# EAGLE design Air Quality Sensor V1.0 (EAGLE 7.7.0)
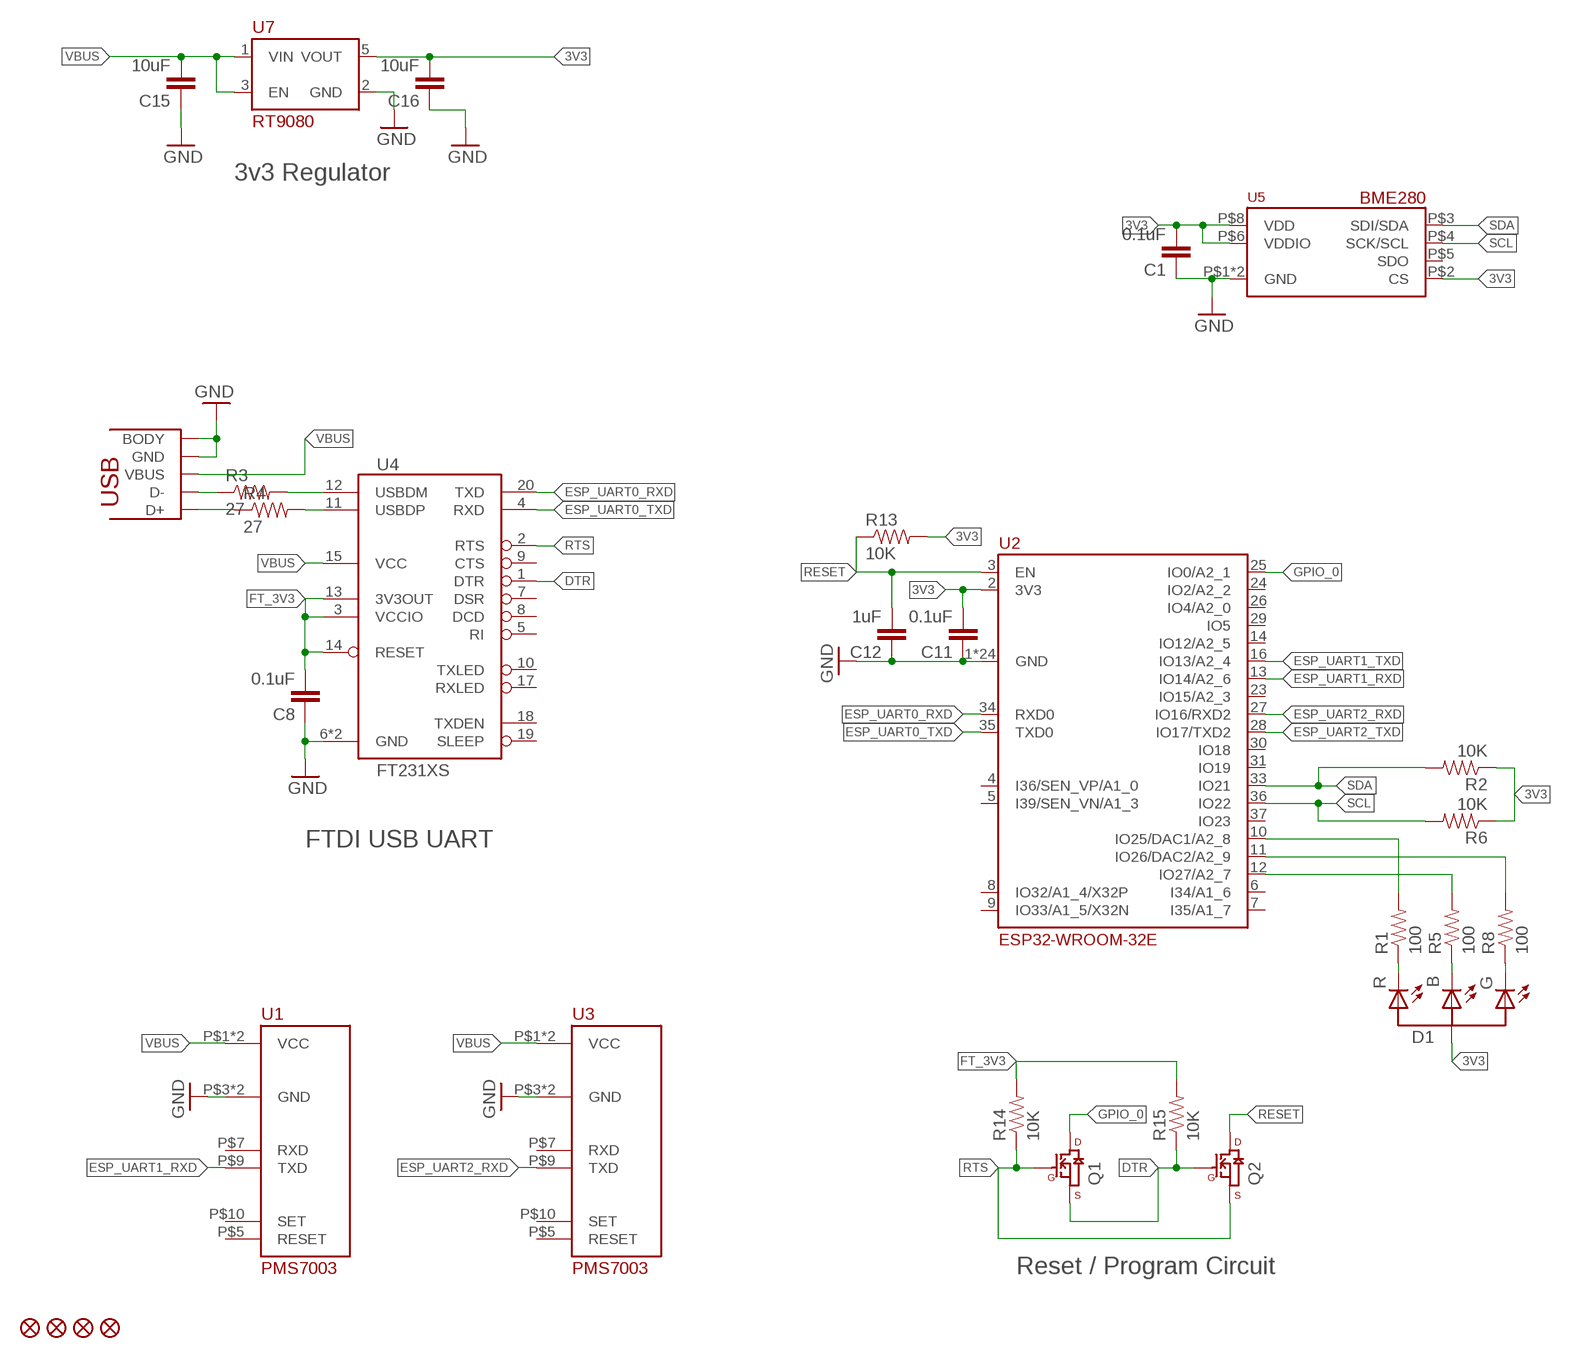
[diagram p0: schematic, sheet 1]

## Parts
C1  0.1uF  CAP0603-CAP  [0603-CAP]
C8  0.1uF  CAP0603-CAP  [0603-CAP]
C11  0.1uF  CAP0603-CAP  [0603-CAP]
C12  1uF  CAP0603-CAP  [0603-CAP]
C15  10uF  CAP1206  [1206]
C16  10uF  CAP1206  [1206]
D1  LED_TRICOLOR_COM-ANODE  [LED_1206_SIDE_TRICOLOR]
FID1  FIDUCIAL  [FIDUCIAL]
FID2  FIDUCIAL  [FIDUCIAL]
FID3  FIDUCIAL  [FIDUCIAL]
FID4  FIDUCIAL  [FIDUCIAL]
Q1  MOSFET_N_CHANNELSI1308  [SC-70-3]
Q2  MOSFET_N_CHANNELSI1308  [SC-70-3]
R1  100  RESISTOR0603-RES  [0603-RES]
R2  10K  RESISTOR0603-RES  [0603-RES]
R3  27  RESISTOR0603-RES  [0603-RES]
R4  27  RESISTOR0603-RES  [0603-RES]
R5  100  RESISTOR0603-RES  [0603-RES]
R6  10K  RESISTOR0603-RES  [0603-RES]
R8  100  RESISTOR0603-RES  [0603-RES]
R13  10K  RESISTOR0603-RES  [0603-RES]
R14  10K  RESISTOR0603-RES  [0603-RES]
R15  10K  RESISTOR0603-RES  [0603-RES]
U1  PMS7003_SMD  [PMS7003_SMD]
U2  ESP32-WROOM-32E  [ESP32-WROOM-32E]
U3  PMS7003_SMD  [PMS7003_SMD]
U4  FT231XS  [SSOP-20]
U5  BME280  [8-VFLGA]
U7  RT9080  [SOT-23-5]
U$1  USB-MICROB  [USB-MICROB-10118192]

## Nets
3V3: C1.2 C11.2 C16.2 D1.P$3(A) R2.1 R6.1 R13.2 U2.2(3V3) U5.P$2(CS) U5.P$6(VDDIO) U5.P$8(VDD) U7.5(VOUT)
DTR: Q1.P$2(S) Q2.P$1(G) R15.1 U4.1(DTR)
ESP_UART0_RXD: U2.34(RXD0) U4.20(TXD)
ESP_UART0_TXD: U2.35(TXD0) U4.4(RXD)
ESP_UART1_RXD: U1.P$9(TXD) U2.13(IO14/A2_6)
ESP_UART1_TXD: U2.16(IO13/A2_4)
ESP_UART2_RXD: U2.27(IO16/RXD2) U3.P$9(TXD)
ESP_UART2_TXD: U2.28(IO17/TXD2)
FT_3V3: C8.2 R14.2 R15.2 U4.3(VCCIO) U4.13(3V3OUT) U4.14(RESET)
GND: C1.1 C8.1 C11.1 C12.1 C15.1 C16.1 U1.P$3(GND) U1.P$4(GND) U2.1(GND) U2.15(GND) U2.38(GND) U2.P$1(GND) U2.P$2(GND) U2.P$3(GND) U2.P$4(GND) U2.P$5(GND) U2.P$6(GND) U2.P$7(GND) U2.P$8(GND) U2.P$9(GND) U2.P$10(GND) U2.P$11(GND) U2.P$12(GND) U2.PAD@1(GND) U2.PAD@2(GND) U2.PAD@3(GND) U2.PAD@4(GND) U2.PAD@5(GND) U2.PAD@6(GND) U2.PAD@7(GND) U2.PAD@8(GND) U2.PAD@9(GND) U3.P$3(GND) U3.P$4(GND) U4.6(GND) U4.16(GND) U5.P$1(GND) U5.P$7(GND) U7.2(GND) U$1.5(GND) U$1.BODY@1(BODY) U$1.BODY@2(BODY) U$1.BODY@3(BODY) U$1.BODY@4(BODY) U$1.BODY@5(BODY) U$1.BODY@6(BODY)
GPIO_0: Q1.P$3(D) U2.25(IO0/A2_1)
N$1: R1.2 U2.10(IO25/DAC1/A2_8)
N$2: R8.2 U2.11(IO26/DAC2/A2_9)
N$3: R5.2 U2.12(IO27/A2_7)
N$4: D1.P$4(C_RED) R1.1
N$5: D1.P$2(C_BLU) R5.1
N$6: D1.P$1(C_GRN) R8.1
N$7: R3.1 U$1.2(D-)
N$8: R4.1 U$1.3(D+)
N$17: R4.2 U4.11(USBDP)
N$18: R3.2 U4.12(USBDM)
RESET: C12.2 Q2.P$3(D) R13.1 U2.3(EN)
RTS: Q1.P$1(G) Q2.P$2(S) R14.1 U4.2(RTS)
SCL: R6.2 U2.36(IO22) U5.P$4(SCK/SCL)
SDA: R2.2 U2.33(IO21) U5.P$3(SDI/SDA)
VBUS: C15.2 U1.P$1(VCC) U1.P$2(VCC) U3.P$1(VCC) U3.P$2(VCC) U4.15(VCC) U7.1(VIN) U7.3(EN) U$1.1(VBUS)
Unconnected: U1.P$5(RESET) U1.P$7(RXD) U1.P$10(SET) U2.4(I36/SEN_VP/A1_0) U2.5(I39/SEN_VN/A1_3) U2.6(I34/A1_6) U2.7(I35/A1_7) U2.8(IO32/A1_4/X32P) U2.9(IO33/A1_5/X32N) U2.14(IO12/A2_5) U2.23(IO15/A2_3) U2.24(IO2/A2_2) U2.26(IO4/A2_0) U2.29(IO5) U2.30(IO18) U2.31(IO19) U2.37(IO23) U3.P$5(RESET) U3.P$7(RXD) U3.P$10(SET) U4.5(RI) U4.7(DSR) U4.8(DCD) U4.9(CTS) U4.10(TXLED) U4.17(RXLED) U4.18(TXDEN) U4.19(SLEEP) U5.P$5(SDO)

## Notes on the sheet
- 3v3 Regulator
- FTDI USB UART
- Reset / Program Circuit

## Library data of the parts
C1 C8 C11 C12 C15 C16 = SparkFun:CAP: Capacitor Standard 0603 ceramic capacitor, and 0.1" leaded capacitor.
D1 = Nigel:LED_TRICOLOR_COM-ANODE
FID1-FID4 = Nigel:FIDUCIAL
Q1 Q2 = Nigel:MOSFET_N_CHANNEL: N-Channel MOSFET
R1-R6 R8 R13-R15 = SparkFun:RESISTOR: Resistor Basic schematic elements and footprints for 0603, 1206, and PTH resistors.
U1 U3 = Nigel:PMS7003
U2 = Nigel:ESP32-WROOM-32E: ESP32-WROOM-32E
U4 = Nigel:FT231XS: FT231XS USB to Full Handshake UART
U5 = Nigel:BME280: BME280 Pressure, Humidity, Temperature Sensor
U7 = Nigel:RT9080: RT9080 Low Quiescent Current LDO Linear Regulator
U$1 = Nigel:USB: USB Micro B Connector Ampehnol Part 10118192-0001LF

## Board
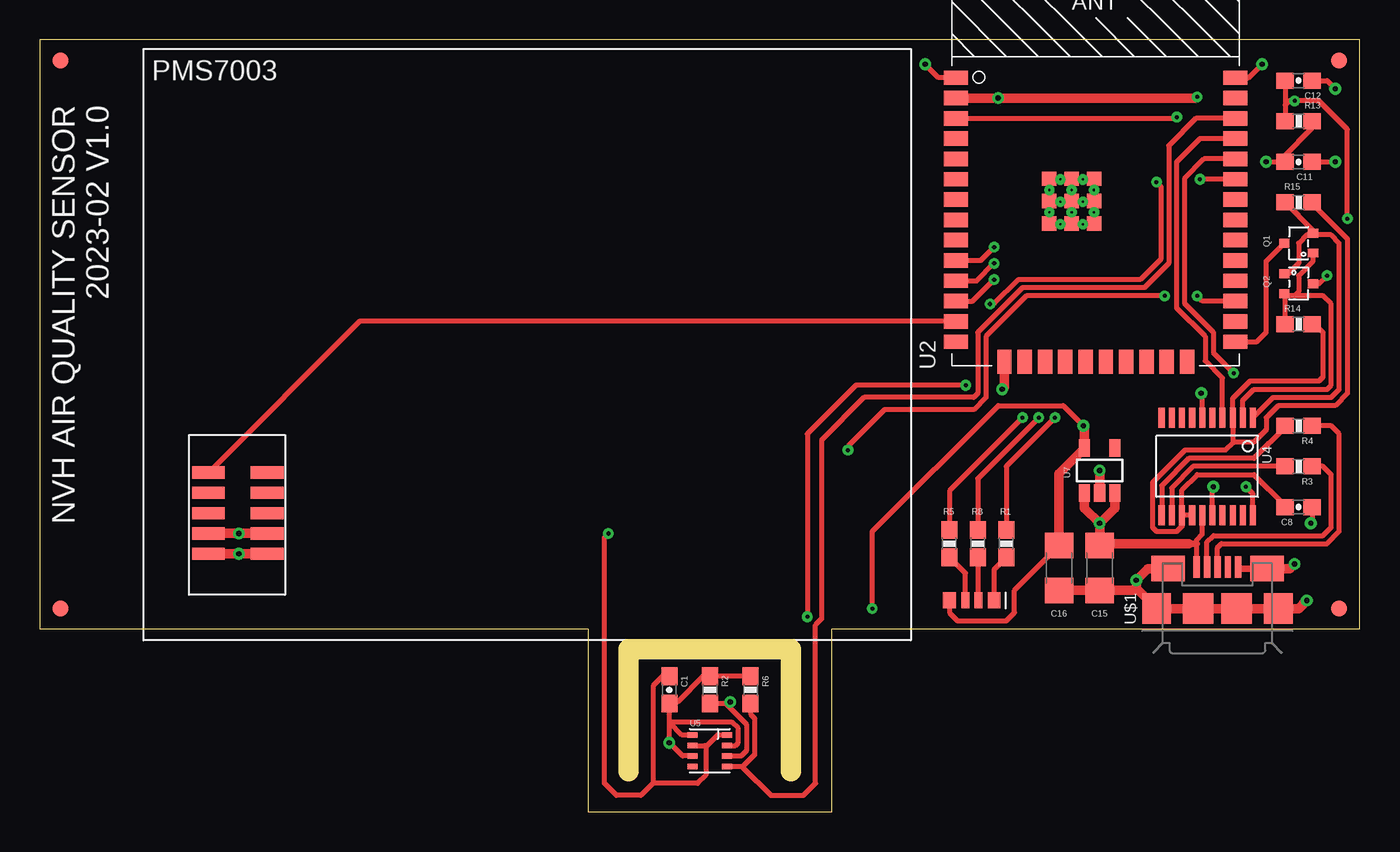
[diagram p1: board, top side]
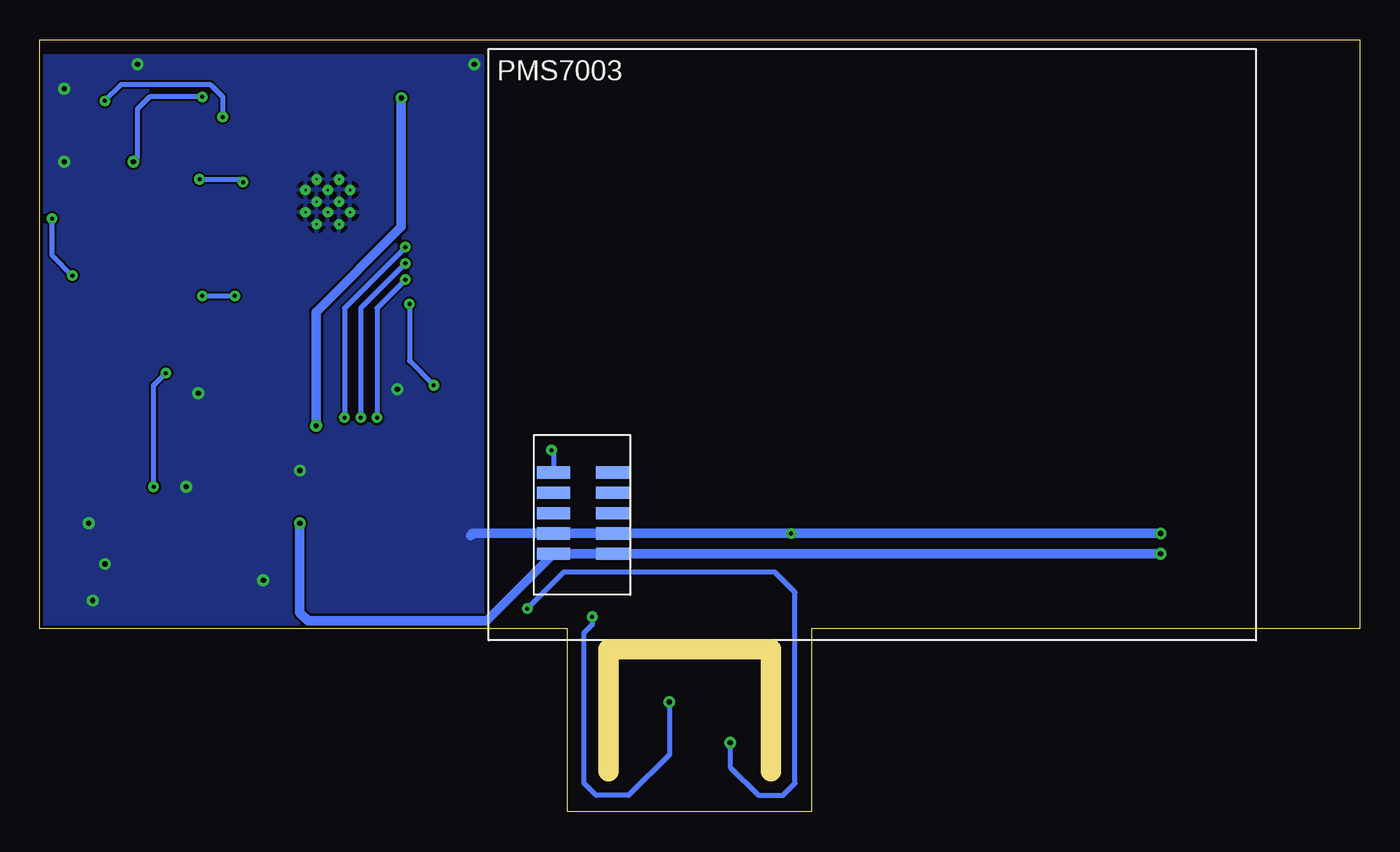
[diagram p2: board, bottom side, seen from below]

Size 82.55 x 48.26 mm. Coordinates in mm from the lower left corner, seen from the top.
Outline: 0,11.43 34.29,11.43 34.29,0 49.53,0 49.53,11.43 82.55,11.43 82.55,48.26 0,48.26 0,11.43
Copper layers (1*16): Top 0.035mm / dielectric 1.5mm / Bottom 0.035mm
Design rules "default *": minimum track width 5mil, minimum drill 8mil, track to track 5mil, track to pad 8mil, pad to pad 8mil, via to via 8mil, smd to smd 8mil, copper to edge 8mil, drill to drill 8mil, minimum pad ring 10mil, minimum via ring 8mil, stop-mask expansion 4mil, vias tented up to drill 12mil, thermal gap 10mil
Milling: 3 lines

### Footprints (pad centres in the part's own frame; a part is rotated, then mirrored left to right if it is on the bottom)
0603-CAP = smd 1.1 x 1: 1 -0.85,0; 2 0.85,0
1206 = smd 1.6 x 1.8: 1 -1.4,0; 2 1.4,0
LED_1206_SIDE_TRICOLOR = smd 0.5 x 1: P$1 1.8,0; P$2 1,0 | smd 0.8 x 1: P$3 0,0; P$4 2.8,0
FIDUCIAL = smd 1 x 1: 1 0,0
SC-70-3 = smd 0.558 x 0.648: P$1 -0.622,-0.895; P$2 0.622,-0.895; P$3 0,0.895
0603-RES = smd 1.1 x 1: 1 -0.85,0; 2 0.85,0
PMS7003_SMD = smd 2.057 x 0.762: P$1 -19.939,-13.081; P$2 -16.256,-13.081; P$3 -19.939,-11.811; P$4 -16.256,-11.811; P$5 -19.939,-10.541; P$6 -16.256,-10.541; P$7 -19.939,-9.271; P$8 -16.256,-9.271; P$9 -19.939,-8.001; P$10 -16.256,-8.001
ESP32-WROOM-32E = smd 1.5 x 0.9: 1 -8.75,5.26; 2 -8.75,3.99; 3 -8.75,2.72; 4 -8.75,1.45; 5 -8.75,0.18; 6 -8.75,-1.09; 7 -8.75,-2.36; 8 -8.75,-3.63; 9 -8.75,-4.9; 10 -8.75,-6.17; 11 -8.75,-7.44; 12 -8.75,-8.71; 13 -8.75,-9.98; 14 -8.75,-11.25; 25 8.75,-11.25; 26 8.75,-9.98; 27 8.75,-8.71; 28 8.75,-7.44; 29 8.75,-6.17; 30 8.75,-4.9; 31 8.75,-3.63; 32 8.75,-2.36; 33 8.75,-1.09; 34 8.75,0.18; 35 8.75,1.45; 36 8.75,2.72; 37 8.75,3.99; 38 8.75,5.26 | smd 0.9 x 1.5: 15 -5.71,-12.5; 16 -4.44,-12.5; 17 -3.17,-12.5; 18 -1.9,-12.5; 19 -0.63,-12.5; 20 0.64,-12.5; 21 1.91,-12.5; 22 3.18,-12.5; 23 4.45,-12.5; 24 5.72,-12.5 | drill 0.13 pad 0.4: P$1 -0.8,-2.5; P$2 -2.2,-2.5; P$3 -2.2,-1.1; P$4 -0.8,-1.1; P$5 -2.2,-3.9; P$6 -0.8,-3.9; P$7 -2.9,-1.76; P$8 -1.5,-1.76; P$9 -0.1,-1.76; P$10 -1.5,-3.16; P$11 -2.9,-3.16; P$12 -0.1,-3.16 | smd 0.9 x 0.9: PAD@1 -1.5,-2.46; PAD@2 -0.1,-2.46; PAD@3 -0.1,-3.86; PAD@4 -1.5,-3.86; PAD@5 -2.9,-3.86; PAD@6 -2.9,-2.46; PAD@7 -2.9,-1.06; PAD@8 -1.5,-1.06; PAD@9 -0.1,-1.06
SSOP-20 = smd 0.381 x 1.27: 1 -2.223,-3.048; 2 -1.587,-3.048; 3 -0.953,-3.048; 4 -0.318,-3.048; 5 0.318,-3.048; 6 0.953,-3.048; 7 1.587,-3.048; 8 2.223,-3.048; 9 2.857,-3.048; 10 3.493,-3.048; 11 3.493,3.048; 12 2.857,3.048; 13 2.223,3.048; 14 1.587,3.048; 15 0.953,3.048; 16 0.318,3.048; 17 -0.318,3.048; 18 -0.953,3.048; 19 -1.587,3.048; 20 -2.223,3.048
8-VFLGA = smd 0.635 x 0.35: P$1 1.079,0.975; P$2 1.079,0.325; P$3 1.079,-0.325; P$4 1.079,-0.975; P$5 -1.079,-0.975; P$6 -1.079,-0.325; P$7 -1.079,0.325; P$8 -1.079,0.975
SOT-23-5 = smd 0.7 x 1.1: 1 -0.95,-1.4; 2 0,-1.4; 3 0.95,-1.4; 4 0.95,1.4; 5 -0.95,1.4
USB-MICROB-10118192 = smd 0.4 x 1.35: 1 -1.3,2.6; 2 -0.65,2.6; 3 0,2.6; 4 0.65,2.6; 5 1.3,2.6 | smd 1.8 x 1.9: BODY@1 -3.8,0; BODY@4 3.8,0 | smd 1.9 x 1.9: BODY@2 -1.2,0; BODY@3 1.2,0 | smd 2.1 x 1.6: BODY@5 -3.1,2.5; BODY@6 3.1,2.5

### Placement (x,y rotation side)
C1  39.37,7.62 270 top
C8  78.74,19.05 180 top
C11  78.74,40.64 180 top
C12  78.74,45.72 180 top
C15  66.29,15.24 90 top
C16  63.75,15.24 90 top
D1  56.9,13.21 0 top
FID1  1.27,12.7 0 top
FID2  81.28,12.7 0 top
FID3  81.28,46.99 0 top
FID4  1.27,46.99 0 top
Q1  78.74,35.56 90 top
Q2  78.74,33.02 270 top
R1  60.45,16.76 90 top
R2  41.91,7.62 270 top
R3  78.74,21.59 180 top
R4  78.74,24.13 180 top
R5  56.9,16.76 90 top
R6  44.45,7.62 270 top
R8  58.67,16.76 90 top
R13  78.74,43.18 0 top
R14  78.74,30.48 0 top
R15  78.74,38.1 0 top
U1  30.48,29.21 0 top
U2  66.04,40.64 0 top
U3  30.48,29.21 0 bottom
U4  73.66,21.59 180 top
U5  41.91,3.81 0 top
U7  66.29,21.34 0 top
U$1  73.66,12.7 0 top

### Tracks (layer width: path | path; a pad name or v marks a point on that pad's centre or on a via)
3V3  (via drill 0.25, 0.33)
  Top 0.305: R6.1 R2.1 41.49,8.47 39.88,6.86 39.46,6.86 C1.2 39.37,5.59 | U5.P$8 40.17,4.79 39.37,5.59 | U5.P$2 43.51,4.13 43.69,4.32 43.69,5.21 43.31,5.59 39.37,5.59 | U5.P$6 40.2,3.48 v39.37,4.32 39.37,5.59 | R13.2 79.5,43.09 79.5,42.67 77.89,41.06 C11.2 v76.71,40.64 | 72.32,44.63 v72.39,44.7 | D1.P$3 56.9,12.45 57.4,11.94 60.45,11.94 60.96,12.45 60.96,13.85 C16.2 | v52.07,12.7 52.07,17.53 59.94,25.4 64.01,25.4 v65.28,24.13
  Top 0.61: U2.2 v59.94,44.63 72.32,44.63 | C16.2 63.75,21.15 U7.5 65.34,24.06 v65.28,24.13
  Bottom 0.305: v39.37,4.32 39.37,2.79 37.59,1.02 36.07,1.02 35.31,1.78 35.31,13.72 36.58,14.99 49.78,14.99 v52.07,12.7 | v72.39,44.7 75.69,44.7 76.45,43.94 76.45,40.89 v76.71,40.64
  Bottom 0.61: v65.28,24.13 65.28,31.24 59.94,36.58 v59.94,44.63
DTR
  Top 0.305: U4.1 77.15,25.91 80.77,25.91 81.28,26.42 81.28,35.56 80.77,36.07 79.75,36.07 | 79.75,36.07 Q1.P$2 79.64,36.35 R15.1 | 79.75,36.07 79.25,36.07 78.74,35.56 78.74,34.29 78.09,33.64 Q2.P$1
ESP_UART0_RXD  (via drill 0.25)
  Top 0.305: U4.20 75.88,19.88 v75.44,20.32 | v74.68,27.43 73.41,28.7 73.41,29.97 71.63,31.75 71.63,39.62 72.82,40.82 U2.34
  Bottom 0.305: v75.44,20.32 75.44,26.67 v74.68,27.43
ESP_UART0_TXD
  Top 0.305: U2.35 72.57,42.09 71.12,40.64 71.12,31.5 72.9,29.72 72.9,28.19 73.98,27.11 U4.4
ESP_UART1_RXD
  Top 0.305: U2.13 19.99,30.66 U1.P$9
ESP_UART2_RXD  (via drill 0.25)
  Top 0.305: U2.27 72.72,31.93 v72.39,32.26 | v70.36,32.26 61.72,32.26 59.18,29.72 59.18,25.91 58.42,25.15 52.83,25.15 50.55,22.86 v50.55,22.61
  Bottom 0.305: v72.39,32.26 v70.36,32.26 | v50.55,22.61 50.42,22.48 U3.P$9
FT_3V3
  Top 0.305: U4.13 71.44,20.13 72.39,21.08 75.95,21.08 77.89,19.14 C8.2 | U4.14 U4.13 | 74.61,23.05 U4.3 74.61,25.84 75.69,26.92 80.01,26.92 80.26,27.18 80.26,29.97 79.76,30.48 R14.2 | 74.61,23.05 74.17,22.61 71.63,22.61 69.6,20.57 69.6,17.78 69.85,17.53 71.12,17.53 71.44,17.84 U4.13 | R15.2 79.59,38.01 81.79,35.81 81.79,26.16 81.03,25.4 77.47,25.4 76.71,24.64 76.71,23.88 75.95,23.11 74.68,23.11 74.61,23.05
GND  (via drill 0.25, 0.33)
  Top 0.305: U5.P$1 42.38,4.79 41.73,4.13 U5.P$7 41.59,4.13 41.66,4.06 41.66,2.29 41.15,1.78 38.35,1.78 | C1.1 38.95,8.47 38.35,7.87 38.35,1.78 | 38.35,1.78 37.59,1.02 36.07,1.02 35.31,1.78 35.31,17.14 v35.56,17.4 | C12.1 80.52,45.72 v81.03,45.21 | U2.38 75.62,45.9 v76.45,46.74 | C11.1 v81.03,40.64 | U4.16 73.34,20.26 v73.41,20.32 | U4.6 72.71,26.1 v72.64,26.16 | C8.1 79.59,18.12 v79.5,18.03 | U2.PAD@7 U2.P$7 | U2.PAD@8 U2.P$8 | U2.PAD@9 U2.P$9 | U2.PAD@2 U2.P$12 U2.PAD@3 | U2.PAD@1 U2.P$10 U2.PAD@4 | U2.PAD@6 U2.P$11 U2.PAD@5 | U2.1 56.21,45.9 v55.37,46.74
  Top 0.406: U$1.5 75.06,15.2 U$1.BODY@6
  Top 0.61: U1.P$3 v12.45,17.4 U1.P$4 | U$1.BODY@6 78.19,15.2 v78.49,15.49 | v79.25,13.21 78.74,12.7 U$1.BODY@4 U$1.BODY@3 U$1.BODY@2 U$1.BODY@1 68.58,13.98 v68.58,14.48 | v68.58,14.48 69.3,15.2 U$1.BODY@5 | U2.15 60.33,26.55 v60.2,26.42 | C16.1 C15.1 68.58,13.84 v68.58,14.48 | U7.2 v66.29,21.34
  Bottom 0.61: 55.63,17.27 55.5,17.4 U3.P$3 U3.P$4 v35.56,17.4 v12.45,17.4
  pour Bottom: 82.55,47.24 82.55,11.43 54.86,11.43 54.86,47.24
GPIO_0
  Top 0.305: U2.25 76.13,29.39 76.71,29.97 76.71,34.42 Q1.P$3
N$1  (via drill 0.25)
  Top 0.305: U2.10 58.85,34.47 v59.69,35.31 | v63.5,24.64 60.45,21.59 R1.2
  Bottom 0.305: v59.69,35.31 63.5,31.5 v63.5,24.64
N$2  (via drill 0.25)
  Top 0.305: U2.11 58.6,33.2 v59.69,34.29 | v62.48,24.64 58.67,20.83 R8.2
  Bottom 0.305: v59.69,34.29 62.48,31.5 v62.48,24.64
N$3  (via drill 0.25)
  Top 0.305: U2.12 58.35,31.93 v59.69,33.27 | v61.47,24.64 56.9,20.07 R5.2
  Bottom 0.305: v59.69,33.27 61.47,31.5 v61.47,24.64
N$4
  Top 0.305: D1.P$4 59.7,15.16 R1.1
N$5
  Top 0.305: D1.P$2 57.9,14.91 R5.1
N$6
  Top 0.305: D1.P$1 58.7,15.89 R8.1
N$7
  Top 0.305: U$1.2 73.01,16.88 73.41,17.27 80.26,17.27 80.77,17.78 80.77,21.08 80.26,21.59 R3.1
N$8
  Top 0.305: U$1.3 73.66,16.51 73.91,16.76 80.52,16.76 81.28,17.53 81.28,23.62 80.77,24.13 R4.1
N$17
  Top 0.305: R4.2 77.89,24.04 75.95,22.1 71.88,22.1 70.17,20.38 U4.11
N$18
  Top 0.305: R3.2 72.14,21.59 70.8,20.26 U4.12
RESET  (via drill 0.25)
  Top 0.305: C12.2 77.89,44.2 | 77.89,44.2 R13.1 | Q2.P$3 80.01,33.02 v80.52,33.53 | 77.89,44.2 78.14,44.45 v78.49,44.45 80.01,44.45 81.79,42.67 v81.79,37.08 | U2.3 71.05,43.36 v71.12,43.43
  Bottom 0.305: v78.49,44.45 77.47,45.47 71.88,45.47 71.12,44.7 v71.12,43.43 | v80.52,33.53 81.79,34.8 v81.79,37.08
RTS
  Top 0.305: U4.2 75.25,25.72 75.95,26.42 80.52,26.42 80.77,26.67 80.77,31.75 80.26,32.26 78.49,32.26 | 78.49,32.26 77.98,32.26 Q2.P$2 77.89,32.35 R14.1 | Q1.P$1 79.64,34.42 78.74,33.53 78.74,32.51 78.49,32.26
SCL
  Top 0.305: R6.2 44.45,6.1 44.7,5.84 44.7,3.56 43.98,2.83 43.98,2.75 | 43.98,2.75 45.72,1.02 47.75,1.02 48.51,1.78 48.51,11.68 48.9,12.06 48.9,23.24 51.56,25.91 58.42,25.91 58.67,26.16 58.67,29.97 61.47,32.77 69.09,32.77 70.61,34.29 70.61,41.66 72.32,43.36 U2.36 | U5.P$4 43.9,2.83 43.98,2.75
SDA  (via drill 0.25, 0.33)
  Top 0.305: R2.2 42.89,6.77 | 42.89,6.77 44.2,5.46 44.2,3.81 43.87,3.48 U5.P$3 | 42.89,6.77 43.09,6.77 v43.18,6.86 | U2.33 v72.57,39.55 | v69.85,39.37 70.1,39.12 70.1,34.54 68.83,33.27 61.21,33.27 59.69,31.75 v59.44,31.75 | v57.91,26.67 51.05,26.67 48.01,23.62 v48.01,12.19
  Bottom 0.305: v43.18,6.86 43.18,3.56 45.72,1.02 47.75,1.02 48.51,1.78 48.51,11.18 48.01,11.68 v48.01,12.19 | v72.57,39.55 70.03,39.55 v69.85,39.37 | v59.44,31.75 59.44,28.19 v57.91,26.67
VBUS  (via drill 0.33)
  Top 0.305: U$1.1 72.36,16.76 72.36,16.99 72.71,17.34 U4.15
  Top 0.406: 71.88,16.76 72.36,16.76
  Top 0.61: 71.88,16.76 66.42,16.76 C15.2 v66.29,18.03 | U1.P$1 v12.45,16.13 U1.P$2 | U7.1 65.34,18.98 v66.29,18.03 | U7.3 67.24,18.98 v66.29,18.03
  Bottom 0.61: v12.45,16.13 U3.P$2 U3.P$1 54.61,11.94 65.79,11.94 66.29,12.45 v66.29,18.03

### Text on the board
tPlace: NVH AIR QUALITY SENSOR / 2023-02 V1.0